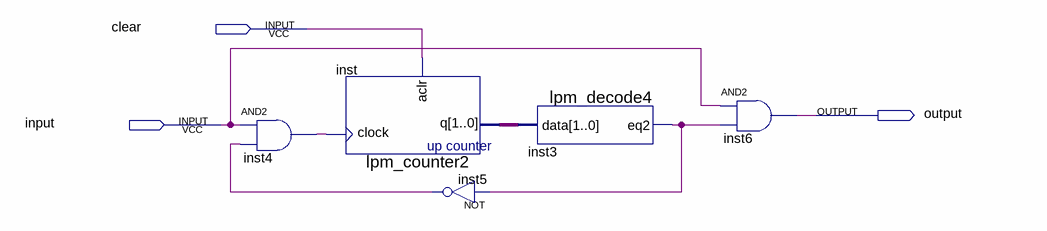
[diagram p0: schematic sheet]
// Quartus schematic blockerFirstImpuls.bdf as structural Verilog: 5 symbols, 3 pins
module blockerFirstImpuls (
  input  clear,
  input  \input ,
  output \output 
);

  wire inst3_eq2, inst4_out, inst5_out;
  wire [1:0] inst_q;

  and inst4 (inst4_out, \input , inst5_out);
  lpm_counter2 inst (.clock(inst4_out), .aclr(clear), .q(inst_q));
  not inst5 (inst5_out, inst3_eq2);
  lpm_decode4 inst3 (.data(inst_q), .eq2(inst3_eq2));
  and inst6 (\output , \input , inst3_eq2);
endmodule
